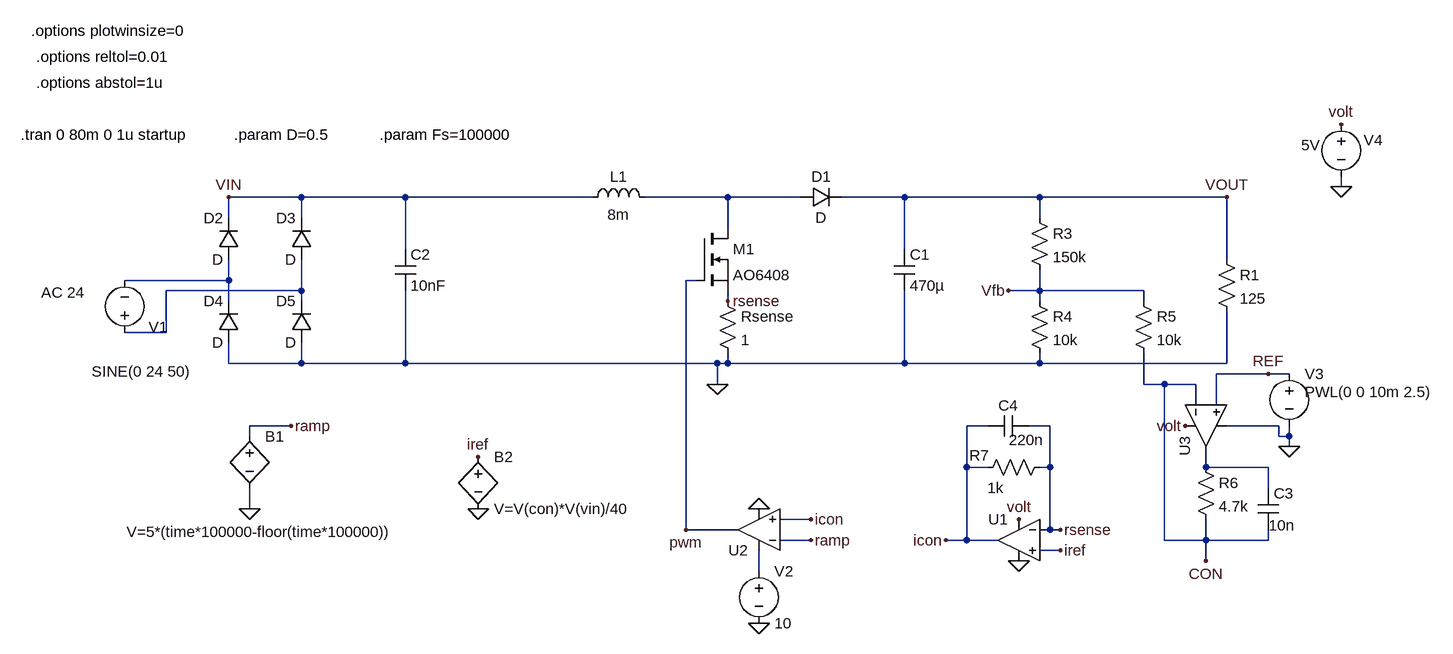
[diagram p0: schematic pfcdone1.asc]
pfcdone1.asc, the LTspice schematic file:
Version 4.1
SHEET 1 1908 888
WIRE 1632 0 1632 -16
WIRE 32 16 -80 16
WIRE 192 16 32 16
WIRE 480 16 192 16
WIRE 688 16 560 16
WIRE 800 16 688 16
WIRE 960 16 864 16
WIRE 1168 16 960 16
WIRE 1456 16 1168 16
WIRE -80 48 -80 16
WIRE 32 48 32 16
WIRE 1168 48 1168 16
WIRE 688 64 688 16
WIRE 192 96 192 16
WIRE 960 96 960 16
WIRE 1456 112 1456 16
WIRE -80 144 -80 112
WIRE -80 144 -240 144
WIRE 640 144 624 144
WIRE 32 160 32 112
WIRE 32 160 -176 160
WIRE 1168 160 1168 128
WIRE 1168 160 1120 160
WIRE 1328 160 1168 160
WIRE -80 176 -80 144
WIRE 32 176 32 160
WIRE 688 176 688 160
WIRE 1168 176 1168 160
WIRE 1328 176 1328 160
WIRE -176 224 -176 160
WIRE -176 224 -240 224
WIRE -80 272 -80 240
WIRE 32 272 32 240
WIRE 32 272 -80 272
WIRE 192 272 192 160
WIRE 192 272 32 272
WIRE 672 272 192 272
WIRE 688 272 688 256
WIRE 688 272 672 272
WIRE 960 272 960 160
WIRE 960 272 688 272
WIRE 1168 272 1168 256
WIRE 1168 272 960 272
WIRE 1456 272 1456 192
WIRE 1456 272 1168 272
WIRE 1520 288 1440 288
WIRE 1552 288 1520 288
WIRE 672 304 672 272
WIRE 1328 304 1328 256
WIRE 1360 304 1328 304
WIRE 1408 304 1360 304
WIRE 1408 336 1408 304
WIRE 1440 336 1440 288
WIRE 16 368 -48 368
WIRE 1088 368 1056 368
WIRE 1184 368 1152 368
WIRE 1536 368 1456 368
WIRE -48 384 -48 368
WIRE 1536 384 1536 368
WIRE 1552 384 1552 368
WIRE 1552 384 1536 384
WIRE 1552 400 1552 384
WIRE 1056 432 1056 368
WIRE 1088 432 1056 432
WIRE 1184 432 1184 368
WIRE 1184 432 1168 432
WIRE 1424 432 1424 400
WIRE 1520 432 1424 432
WIRE 1520 464 1520 432
WIRE -48 496 -48 464
WIRE 816 512 768 512
WIRE 624 528 624 144
WIRE 704 528 624 528
WIRE 1184 528 1184 432
WIRE 1184 528 1168 528
WIRE 1200 528 1184 528
WIRE 816 544 768 544
WIRE 1056 544 1056 432
WIRE 1056 544 1024 544
WIRE 1104 544 1056 544
WIRE 1360 544 1360 304
WIRE 1424 544 1424 512
WIRE 1424 544 1360 544
WIRE 1520 544 1520 528
WIRE 1520 544 1424 544
WIRE 1200 560 1168 560
WIRE 1424 576 1424 544
WIRE 736 592 736 560
FLAG 672 304 0
FLAG -80 16 VIN
FLAG 1456 16 VOUT
FLAG 1120 160 Vfb
FLAG 1552 400 0
FLAG -48 496 0
FLAG 1632 0 0
FLAG 1520 288 REF
FLAG 1424 576 CON
FLAG 16 368 ramp
FLAG 688 176 rsense
FLAG 1632 -96 volt
FLAG 304 496 0
FLAG 304 416 iref
FLAG 1136 512 volt
FLAG 1392 368 volt
FLAG 1136 576 0
FLAG 1200 560 iref
FLAG 1200 528 rsense
FLAG 1024 544 icon
FLAG 736 496 0
FLAG 816 512 icon
FLAG 816 544 ramp
FLAG 624 528 pwm
FLAG 736 672 0
SYMBOL voltage -240 240 R180
WINDOW 123 62 77 Left 2
WINDOW 39 0 0 Left 0
WINDOW 0 -66 24 Left 2
WINDOW 3 -102 -44 Left 2
SYMATTR Value2 AC 24
SYMATTR InstName V1
SYMATTR Value SINE(0 24 50)
SYMBOL ind 464 32 R270
WINDOW 0 32 56 VTop 2
WINDOW 3 5 56 VBottom 2
SYMATTR InstName L1
SYMATTR Value 8m
SYMATTR SpiceLine Rser=0.1
SYMBOL cap 944 96 R0
SYMATTR InstName C1
SYMATTR Value 470µ
SYMATTR SpiceLine Rser=0.05
SYMBOL nmos 640 64 R0
SYMATTR InstName M1
SYMATTR Value AO6408
SYMBOL res 1440 96 R0
SYMATTR InstName R1
SYMATTR Value 125
SYMBOL diode 800 32 R270
WINDOW 0 32 32 VTop 2
WINDOW 3 0 32 VBottom 2
SYMATTR InstName D1
SYMBOL diode -64 112 R180
WINDOW 0 24 64 Left 2
WINDOW 3 24 0 Left 2
SYMATTR InstName D2
SYMBOL diode 48 112 R180
WINDOW 0 24 64 Left 2
WINDOW 3 24 0 Left 2
SYMATTR InstName D3
SYMBOL diode -64 240 R180
WINDOW 0 24 64 Left 2
WINDOW 3 24 0 Left 2
SYMATTR InstName D4
SYMBOL diode 48 240 R180
WINDOW 0 24 64 Left 2
WINDOW 3 24 0 Left 2
SYMATTR InstName D5
SYMBOL cap 176 96 R0
SYMATTR InstName C2
SYMATTR Value 10nF
SYMATTR SpiceLine Rser=0.05
SYMBOL res 672 160 R0
SYMATTR InstName Rsense
SYMATTR Value 1
SYMBOL res 1152 32 R0
SYMATTR InstName R3
SYMATTR Value 150k
SYMBOL res 1152 160 R0
SYMATTR InstName R4
SYMATTR Value 10k
SYMBOL voltage 1552 272 R0
WINDOW 3 24 44 Left 2
WINDOW 123 0 0 Left 0
WINDOW 39 0 0 Left 0
SYMATTR Value PWL(0 0 10m 2.5)
SYMATTR InstName V3
SYMBOL bv -48 368 R0
WINDOW 3 -189 163 Left 2
SYMATTR Value V=5*(time*100000-floor(time*100000))
SYMATTR InstName B1
SYMBOL voltage 1632 -112 R0
WINDOW 0 35 40 Left 2
WINDOW 3 -61 48 Left 2
WINDOW 123 0 0 Left 0
WINDOW 39 0 0 Left 0
SYMATTR InstName V4
SYMATTR Value 5V
SYMBOL OpAmps\\UniversalOpAmp2 1424 368 M90
SYMATTR InstName U3
SYMBOL OpAmps\\UniversalOpAmp2 1136 544 M0
SYMATTR InstName U1
SYMBOL cap 1504 464 R0
WINDOW 3 17 57 Left 2
SYMATTR Value 10n
SYMATTR InstName C3
SYMATTR SpiceLine Rser=0.05
SYMBOL res 1312 160 R0
SYMATTR InstName R5
SYMATTR Value 10k
SYMBOL res 1408 416 R0
SYMATTR InstName R6
SYMATTR Value 4.7k
SYMBOL bv 304 400 R0
SYMATTR InstName B2
SYMATTR Value V=V(con)*V(vin)/40
SYMBOL res 1184 416 R90
WINDOW 0 13 109 VBottom 2
WINDOW 3 32 84 VTop 2
SYMATTR InstName R7
SYMATTR Value 1k
SYMBOL cap 1152 352 R90
WINDOW 0 0 32 VBottom 2
WINDOW 3 22 4 VTop 2
SYMATTR InstName C4
SYMATTR Value 220n
SYMATTR SpiceLine Rser=0.05
SYMBOL OpAmps\\UniversalOpAmp2 736 528 R180
SYMATTR InstName U2
SYMBOL voltage 736 576 R0
SYMATTR InstName V2
SYMATTR Value 10
TEXT -72 -80 Left 2 !.param D=0.5
TEXT 152 -80 Left 2 !.param Fs=100000
TEXT -400 -80 Left 2 !.tran 0 80m 0 1u startup
TEXT -384 -240 Left 2 !.options plotwinsize=0
TEXT -376 -200 Left 2 !.options reltol=0.01
TEXT -376 -160 Left 2 !.options abstol=1u

The netlist it stands for:
* pfcdone1.asc
V1 N003 N002 SINE(0 24 50) AC 24
L1 VIN N001 8m Rser=0.1
C1 VOUT 0 470µ Rser=0.05
M1 N001 pwm rsense rsense AO6408
R1 VOUT 0 125
D1 N001 VOUT D
D2 N002 VIN D
D3 N003 VIN D
D4 0 N002 D
D5 0 N003 D
C2 VIN 0 10nF Rser=0.05
Rsense rsense 0 1
R3 VOUT Vfb 150k
R4 Vfb 0 10k
V3 REF 0 PWL(0 0 10m 2.5)
B1 ramp 0 V=5*(time*100000-floor(time*100000))
V4 volt 0 5V
X§U3 REF CON volt 0 N004 level2 Avol=1Meg GBW=10Meg Slew=10Meg Ilimit=25m Rail=0 Vos=0 En=0 Enk=0 In=0 Ink=0 Rin=500Meg  ; pins In+ In- V+ V- OUT
X§U1 iref rsense volt 0 icon level2 Avol=1Meg GBW=10Meg Slew=10Meg Ilimit=25m Rail=0 Vos=0 En=0 Enk=0 In=0 Ink=0 Rin=500Meg  ; pins In+ In- V+ V- OUT
C3 N004 CON 10n Rser=0.05
R5 Vfb CON 10k
R6 N004 CON 4.7k
B2 iref 0 V=V(con)*V(vin)/40
R7 rsense icon 1k
C4 rsense icon 220n Rser=0.05
X§U2 icon ramp N005 0 pwm level2 Avol=1Meg GBW=10Meg Slew=10Meg Ilimit=25m Rail=0 Vos=0 En=0 Enk=0 In=0 Ink=0 Rin=500Meg  ; pins In+ In- V+ V- OUT
V2 N005 0 10
.model D D
.lib standard.dio
.model NMOS NMOS
.model PMOS PMOS
.lib standard.mos
.param D=0.5
.param Fs=100000
.tran 0 80m 0 1u startup
.options plotwinsize=0
.options reltol=0.01
.options abstol=1u
.lib UniversalOpAmp2.lib
.backanno
.end